# Altium project IOT_Masterv2_301115.PrjPcb
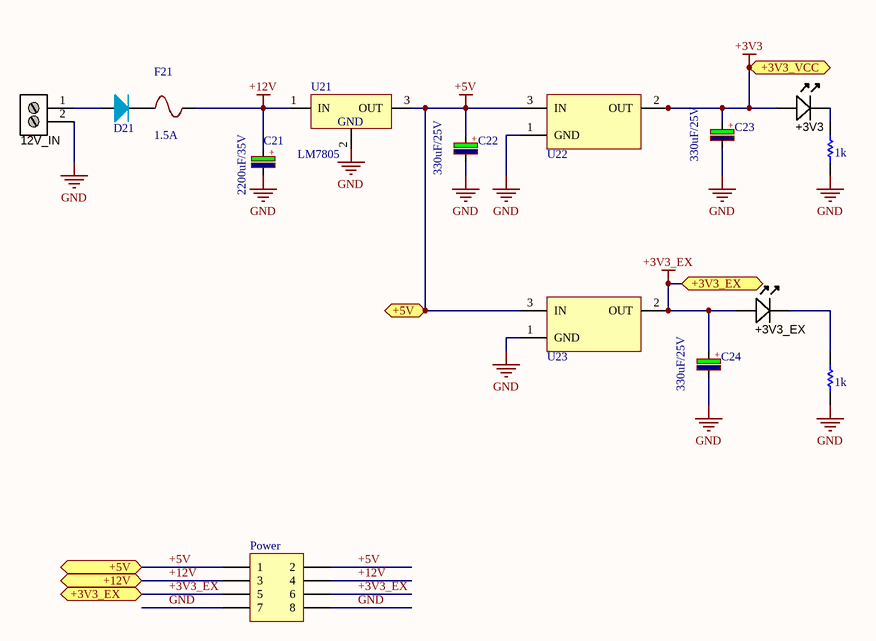
[diagram p0: IOT_Masterv2_301115_Power.SchDoc]
3 sheets, 104 parts. Net scope: flat (ports and power ports of the same name join across sheets).
Board file: IOT_Masterv2_301115.PcbDoc
Sheets:
  IOT_Masterv2_301115_Power.SchDoc
  IOT_Masterv2_301115_Comunication.SchDoc
  Measure_v2_301115.SchDoc

## Sheet IOT_Masterv2_301115_Power.SchDoc
size A

### Parts
12V_IN  Stackable ScrewTerm  [2P_PCB_ScrewTerm_200mil]  (value not drawn)
+3V3  Blue  [LED-0805-K]  (value not drawn)
+3V3_EX  Blue  [LED-0805-K]  (value not drawn)
C21  2200uF/35V  [CP_1000uF_25V]
C22  330uF/25V  [CP1.5/3.4]
C23  330uF/25V  [CP1.5/3.4]
C24  330uF/25V  [CP1.5/3.4]
D21  Diode  [DO-214AC]  (value not drawn)
F21  1.5A  [FUSE_SR-5-BK]
Power  Header 4X2  [HDR2X4]  (value not drawn)
R21  value 1k  [RESC2012N_F]  (hidden comment: Res_0805_1k)
R22  value 1k  [RESC2012N_F]  (hidden comment: Res_0805_1k)
U21  LM7805  [TO-220]
U22  AS1117  [SOT223-4N]  (value not drawn)
U23  AS1117  [SOT223-4N]  (value not drawn)

### Ports
+3V3_EX, +3V3_VCC, +5V, +12V

### Nets
+3V3: +3V3.A C23.1 U22.2(OUT) U22.4 ; port +3V3_VCC
+3V3_EX: +3V3_EX.A C24.1 Power.5 Power.6 U23.2(OUT) U23.4 ; port +3V3_EX
+5V: C22.1 Power.1 Power.2 U21.3(OUT) U22.3(IN) U23.3(IN) ; port +5V
+12V: C21.1 F21.2 Power.3 Power.4 U21.1(IN) ; port +12V
GND: 12V_IN.2 C21.2 C22.2 C23.2 C24.2 Power.7 Power.8 R21.2 R22.2 U21.2 U22.1(GND) U23.1(GND)
Net12V_IN_1: 12V_IN.1 D21.1(A)
Net+3V3_EX_K: +3V3_EX.K R22.1
Net+3V3_K: +3V3.K R21.1
NetD21_2: D21.2(K) F21.1

### Notes on the sheet
- (in symbol CP4) +
- (in symbol LM78xx) GND

### Library data of the parts
12V_IN = 2P_ScrewTerm_90S_3.81MM: Terminal Block Screw Type THT 2-Position 3.81mm pitch; Manufacturer 1: Tyco Electronics; Manufacturer Part Number 1: 1776113-2; Value: 2 position; Pitch: 0.150" (3.81mm); Positions Per Level: 2; Package / Case: Side Entry; 3.81mm pitch; Category: Connectors Interconnects; Color: Black; Supplier 1: Digi-Key; Supplier Part Number 1: A97976-ND
+3V3 +3V3_EX = LED_SMD_Blue_0805_100mcd: LED 0805 SMD Blue 100mcd 470nm; Manufacturer 1: Ligitek; Manufacturer Part Number 1: LG-170DBKZ-CT; Ratings: 100 mcd; 470 nm; Package / Case: 0805; Material: InGaN/GaN; Value: Blue; Color: Blue
C21-C24 = CP4: Cap 1000uF/16V - 220uF/50V; Description 5: 4,7uF>10uF/250V_3,3uF>10uF/400V - 2,2uF>4,7uF/450V; Description 1: 2200uF-3300uF/6,3V - 1000uF-2200uF/10V; Description 2: 1000uF/16V - 470uF => 1000uF/25V - 100uF/100V; Description 3: 330uF>470uF/35V_220uF>470uF/50V_10uF>22uF/250V; Description 4: 220uF => 330uF/63V - 10uF =>33uF/160 - 200V; Value: 1000uF/16V
D21 = Diode: pin to pad: 1>A 2>K
F21 = Fuse
Power = Header 4X2: Header, 4-Pin, Dual row; LatestRevisionDate: 17-Jul-2002; LatestRevisionNote: Re-released for DXP Platform.; Publisher: Altium Limited
R21 R22 = Res
U21 = LM78xx

## Sheet IOT_Masterv2_301115_Comunication.SchDoc
size A
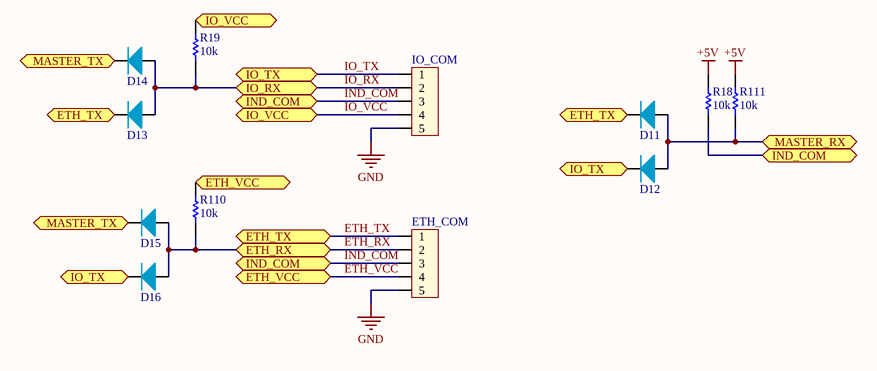
[diagram p1: IOT_Masterv2_301115_Comunication.SchDoc]

### Parts
D11  Diode  [DO-214AC]  (value not drawn)
D12  Diode  [DO-214AC]  (value not drawn)
D13  Diode  [DO-214AC]  (value not drawn)
D14  Diode  [DO-214AC]  (value not drawn)
D15  Diode  [DO-214AC]  (value not drawn)
D16  Diode  [DO-214AC]  (value not drawn)
ETH_COM  JP5  [CON5]  (value not drawn)
IO_COM  JP5  [CON5]  (value not drawn)
R18  value 10k  [RESC2012N_F]  (hidden comment: Res)
R19  value 10k  [RESC2012N_F]  (hidden comment: Res)
R110  value 10k  [RESC2012N_F]  (hidden comment: Res)
R111  value 10k  [RESC2012N_F]  (hidden comment: Res)

### Ports
ETH_RX, ETH_TX, ETH_VCC, IND_COM, IO_RX, IO_TX, IO_VCC, MASTER_RX, MASTER_TX

### Nets
+5V: R18.2 R111.2
GND: ETH_COM.5 IO_COM.5
ETH_RX: D15.1(A) D16.1(A) ETH_COM.2 R110.1 ; port ETH_RX
ETH_TX: D11.2(K) D13.2(K) ETH_COM.1 ; port ETH_TX
ETH_VCC: ETH_COM.4 R110.2 ; port ETH_VCC
IND_COM: ETH_COM.3 IO_COM.3 R18.1 ; port IND_COM
IO_RX: D13.1(A) D14.1(A) IO_COM.2 R19.1 ; port IO_RX
IO_TX: D12.2(K) D16.2(K) IO_COM.1 ; port IO_TX
IO_VCC: IO_COM.4 R19.2 ; port IO_VCC
NetD11_1: D11.1(A) D12.1(A) R111.1 ; port MASTER_RX
NetD14_2: D14.2(K) D15.2(K) ; port MASTER_TX

### Library data of the parts
D11-D16 = Diode: pin to pad: 1>A 2>K
ETH_COM IO_COM = Con5: Connector 5; Value: Connector 5

## Sheet Measure_v2_301115.SchDoc
size A3
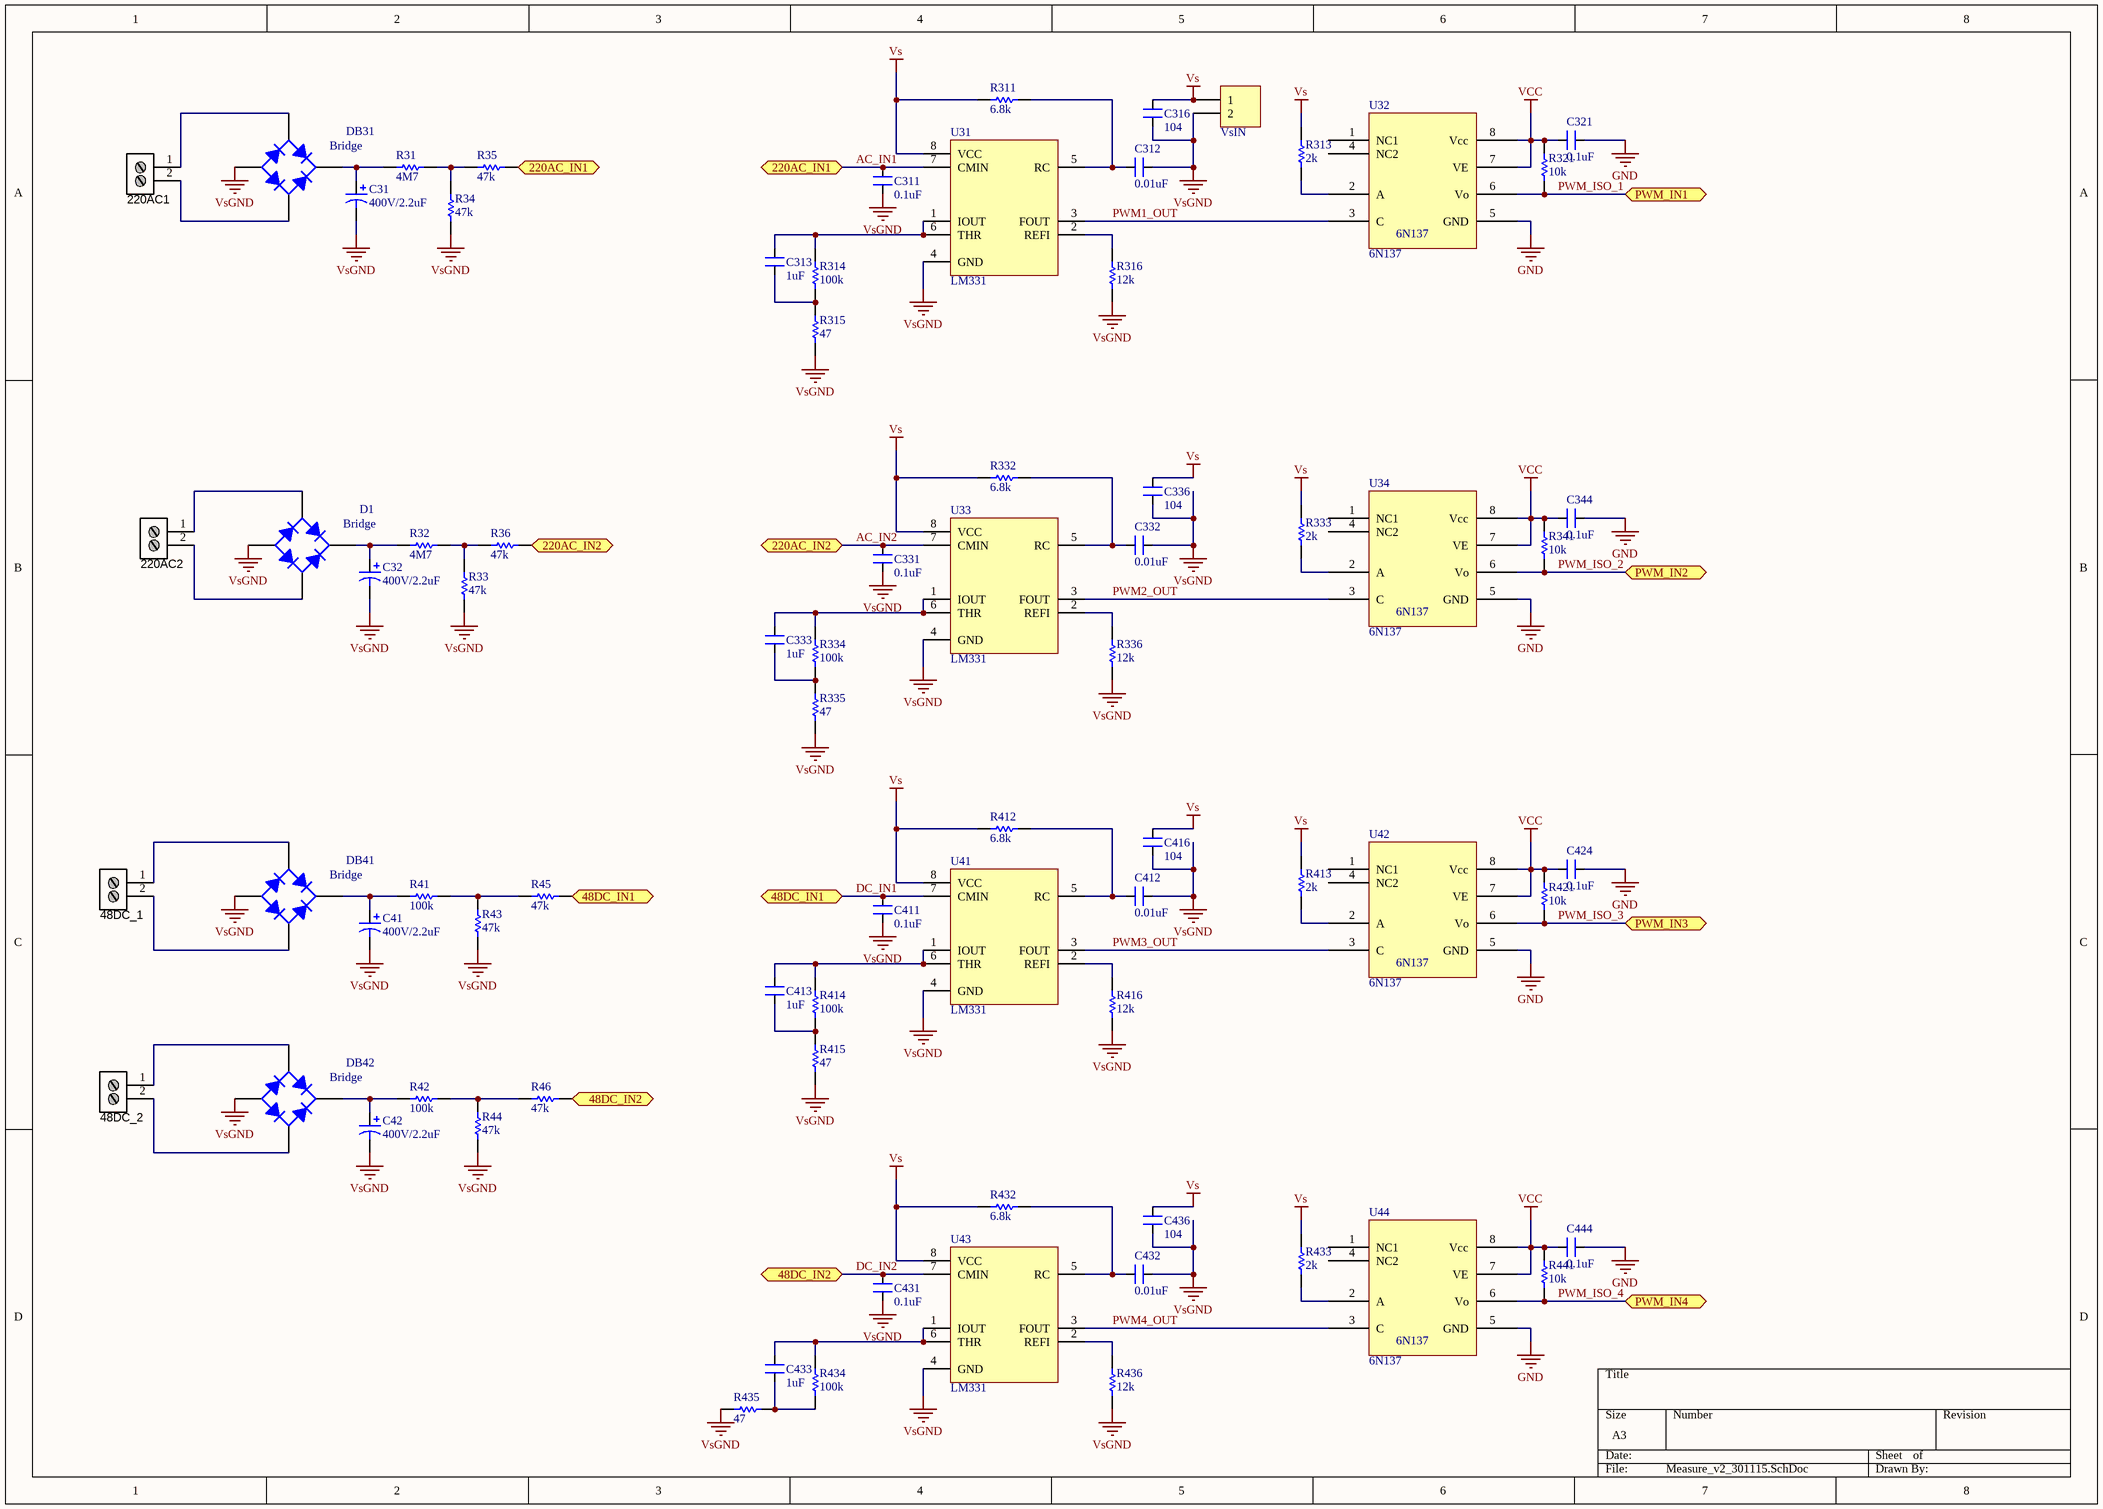
[diagram p2: Measure_v2_301115.SchDoc]

### Parts
48DC_1  Stackable ScrewTerm  [2P_PCB_ScrewTerm_200mil]  (value not drawn)
48DC_2  Stackable ScrewTerm  [2P_PCB_ScrewTerm_200mil]  (value not drawn)
220AC1  Stackable ScrewTerm  [2P_PCB_ScrewTerm_200mil]  (value not drawn)
220AC2  Stackable ScrewTerm  [2P_PCB_ScrewTerm_200mil]  (value not drawn)
C31  value 400V/2.2uF  [CAP 3.8mm]  (hidden comment: Cap)
C32  value 400V/2.2uF  [CAP 3.8mm]  (hidden comment: Cap)
C41  value 400V/2.2uF  [CAP 3.8mm]  (hidden comment: Cap)
C42  value 400V/2.2uF  [CAP 3.8mm]  (hidden comment: Cap)
C311  value 0.1uF  [CAPC2012N_F]  (hidden comment: CAP NP)
C312  value 0.01uF  [CAPC2012N_F]  (hidden comment: CAP NP)
C313  value 1uF  [CAPC2012N_F]  (hidden comment: CAP NP)
C316  value 104  [CAPC2012N_F]  (hidden comment: CAP NP)
C321  value 0.1uF  [CAPC2012N_F]  (hidden comment: CAP NP)
C331  value 0.1uF  [CAPC2012N_F]  (hidden comment: CAP NP)
C332  value 0.01uF  [CAPC2012N_F]  (hidden comment: CAP NP)
C333  value 1uF  [CAPC2012N_F]  (hidden comment: CAP NP)
C336  value 104  [CAPC2012N_F]  (hidden comment: CAP NP)
C344  value 0.1uF  [CAPC2012N_F]  (hidden comment: CAP NP)
C411  value 0.1uF  [CAPC2012N_F]  (hidden comment: CAP NP)
C412  value 0.01uF  [CAPC2012N_F]  (hidden comment: CAP NP)
C413  value 1uF  [CAPC2012N_F]  (hidden comment: CAP NP)
C416  value 104  [CAPC2012N_F]  (hidden comment: CAP NP)
C424  value 0.1uF  [CAPC2012N_F]  (hidden comment: CAP NP)
C431  value 0.1uF  [CAPC2012N_F]  (hidden comment: CAP NP)
C432  value 0.01uF  [CAPC2012N_F]  (hidden comment: CAP NP)
C433  value 1uF  [CAPC2012N_F]  (hidden comment: CAP NP)
C436  value 104  [CAPC2012N_F]  (hidden comment: CAP NP)
C444  value 0.1uF  [CAPC2012N_F]  (hidden comment: CAP NP)
D1  Bridge  [MB6S]
DB31  Bridge  [MB6S]
DB41  Bridge  [MB6S]
DB42  Bridge  [MB6S]
R31  value 4M7  [RESTH_0.0R_AXIAL-0.6]  (hidden comment: Res)
R32  value 4M7  [RESTH_0.0R_AXIAL-0.6]  (hidden comment: Res)
R33  value 47k  [RESTH_0.0R_AXIAL-0.6]  (hidden comment: Res)
R34  value 47k  [RESTH_0.0R_AXIAL-0.6]  (hidden comment: Res)
R35  value 47k  [RESC2012N_F]  (hidden comment: Res)
R36  value 47k  [RESC2012N_F]  (hidden comment: Res)
R41  value 100k  [RESTH_0.0R_AXIAL-0.6]  (hidden comment: Res)
R42  value 100k  [RESTH_0.0R_AXIAL-0.6]  (hidden comment: Res)
R43  value 47k  [RESTH_0.0R_AXIAL-0.6]  (hidden comment: Res)
R44  value 47k  [RESTH_0.0R_AXIAL-0.6]  (hidden comment: Res)
R45  value 47k  [RESC2012N_F]  (hidden comment: Res)
R46  value 47k  [RESC2012N_F]  (hidden comment: Res)
R311  value 6.8k  [RESC2012N_F]  (hidden comment: Res)
R313  value 2k  [RESC2012N_F]  (hidden comment: Res)
R314  value 100k  [RESC2012N_F]  (hidden comment: Res)
R315  value 47  [RESC2012N_F]  (hidden comment: Res)
R316  value 12k  [RESC2012N_F]  (hidden comment: Res)
R321  value 10k  [RESC2012N_F]  (hidden comment: Res)
R332  value 6.8k  [RESC2012N_F]  (hidden comment: Res)
R333  value 2k  [RESC2012N_F]  (hidden comment: Res)
R334  value 100k  [RESC2012N_F]  (hidden comment: Res)
R335  value 47  [RESC2012N_F]  (hidden comment: Res)
R336  value 12k  [RESC2012N_F]  (hidden comment: Res)
R341  value 10k  [RESC2012N_F]  (hidden comment: Res)
R412  value 6.8k  [RESC2012N_F]  (hidden comment: Res)
R413  value 2k  [RESC2012N_F]  (hidden comment: Res)
R414  value 100k  [RESC2012N_F]  (hidden comment: Res)
R415  value 47  [RESC2012N_F]  (hidden comment: Res)
R416  value 12k  [RESC2012N_F]  (hidden comment: Res)
R421  value 10k  [RESC2012N_F]  (hidden comment: Res)
R432  value 6.8k  [RESC2012N_F]  (hidden comment: Res)
R433  value 2k  [RESC2012N_F]  (hidden comment: Res)
R434  value 100k  [RESC2012N_F]  (hidden comment: Res)
R435  value 47  [RESC2012N_F]  (hidden comment: Res)
R436  value 12k  [RESC2012N_F]  (hidden comment: Res)
R441  value 10k  [RESC2012N_F]  (hidden comment: Res)
U31  LM331  [DIP8-300]
U32  6N137  [SMD-8]
U33  LM331  [DIP8-300]
U34  6N137  [SMD-8]
U41  LM331  [DIP8-300]
U42  6N137  [SMD-8]
U43  LM331  [DIP8-300]
U44  6N137  [SMD-8]
VsIN  Header 2  [HDR1X2]  (value not drawn)

### Ports
48DC_IN1, 48DC_IN2, 220AC_IN1, 220AC_IN2, PWM_IN1, PWM_IN2, PWM_IN3, PWM_IN4

### Nets
GND: C321.1 C344.1 C424.1 C444.1 U32.5(GND) U34.5(GND) U42.5(GND) U44.5(GND)
VCC: C321.2 C344.2 C424.2 C444.2 R321.2 R341.2 R421.2 R441.2 U32.7(VE) U32.8(Vcc) U34.7(VE) U34.8(Vcc) U42.7(VE) U42.8(Vcc) U44.7(VE) U44.8(Vcc)
Vs: C316.2 C336.2 C416.2 C436.2 R311.1 R313.2 R332.1 R333.2 R412.1 R413.2 R432.1 R433.2 U31.8(VCC) U33.8(VCC) U41.8(VCC) U43.8(VCC) VsIN.1
VsGND: C31.2 C32.2 C41.2 C42.2 C311.1 C312.1 C316.1 C331.1 C332.1 C336.1 C411.1 C412.1 C416.1 C431.1 C432.1 C436.1 D1.3(A) DB31.3(A) DB41.3(A) DB42.3(A) R33.1 R34.1 R43.1 R44.1 R315.1 R316.1 R335.1 R336.1 R415.1 R416.1 R435.2 R436.1 U31.4(GND) U33.4(GND) U41.4(GND) U43.4(GND) VsIN.2
AC_IN1: C311.2 R35.2 U31.7(CMIN) ; port 220AC_IN1
AC_IN2: C331.2 R36.2 U33.7(CMIN) ; port 220AC_IN2
DC_IN1: C411.2 R45.2 U41.7(CMIN) ; port 48DC_IN1
DC_IN2: C431.2 R46.2 U43.7(CMIN) ; port 48DC_IN2
PWM1_OUT: U31.3(FOUT) U32.3(C)
PWM2_OUT: U33.3(FOUT) U34.3(C)
PWM3_OUT: U41.3(FOUT) U42.3(C)
PWM4_OUT: U43.3(FOUT) U44.3(C)
PWM_ISO_1: R321.1 U32.6(Vo) ; port PWM_IN1
PWM_ISO_2: R341.1 U34.6(Vo) ; port PWM_IN2
PWM_ISO_3: R421.1 U42.6(Vo) ; port PWM_IN3
PWM_ISO_4: R441.1 U44.6(Vo) ; port PWM_IN4
Net48DC_1_1: 48DC_1.1 DB41.4(C)
Net48DC_1_2: 48DC_1.2 DB41.2(C)
Net48DC_2_1: 48DC_2.1 DB42.4(C)
Net48DC_2_2: 48DC_2.2 DB42.2(C)
Net220AC1_1: 220AC1.1 DB31.4(C)
Net220AC1_2: 220AC1.2 DB31.2(C)
Net220AC2_1: 220AC2.1 D1.4(C)
Net220AC2_2: 220AC2.2 D1.2(C)
NetC31_1: C31.1 DB31.1(K) R31.1
NetC32_1: C32.1 D1.1(K) R32.1
NetC41_1: C41.1 DB41.1(K) R41.1
NetC42_1: C42.1 DB42.1(K) R42.1
NetC312_2: C312.2 R311.2 U31.5(RC)
NetC313_1: C313.1 R314.2 U31.1(IOUT) U31.6(THR)
NetC313_2: C313.2 R314.1 R315.2
NetC332_2: C332.2 R332.2 U33.5(RC)
NetC333_1: C333.1 R334.2 U33.1(IOUT) U33.6(THR)
NetC333_2: C333.2 R334.1 R335.2
NetC412_2: C412.2 R412.2 U41.5(RC)
NetC413_1: C413.1 R414.2 U41.1(IOUT) U41.6(THR)
NetC413_2: C413.2 R414.1 R415.2
NetC432_2: C432.2 R432.2 U43.5(RC)
NetC433_1: C433.1 R434.2 U43.1(IOUT) U43.6(THR)
NetC433_2: C433.2 R434.1 R435.1
NetR31_2: R31.2 R34.2 R35.1
NetR32_2: R32.2 R33.2 R36.1
NetR41_2: R41.2 R43.2 R45.1
NetR42_2: R42.2 R44.2 R46.1
NetR313_1: R313.1 U32.2(A)
NetR316_2: R316.2 U31.2(REFI)
NetR333_1: R333.1 U34.2(A)
NetR336_2: R336.2 U33.2(REFI)
NetR413_1: R413.1 U42.2(A)
NetR416_2: R416.2 U41.2(REFI)
NetR433_1: R433.1 U44.2(A)
NetR436_2: R436.2 U43.2(REFI)

Not connected (* = marked no-connect by the designer): U32 1(NC1) 4(NC2); U34 1(NC1) 4(NC2); U42 1(NC1) 4(NC2); U44 1(NC1) 4(NC2)

### Library data of the parts
48DC_1 48DC_2 220AC1 220AC2 = 2P_ScrewTerm_90S_3.81MM: as 12V_IN on sheet IOT_Masterv2_301115_Power; Package / Case: Side Entry; 3.81mm pitch; Category: Connectors Interconnects; Color: Black; Supplier 1: Digi-Key; Supplier Part Number 1: A97976-ND
D1 DB31 DB41 DB42 = Bridge1: Full Wave Diode Bridge; pin to pad: 2>3 3>4 4>2; Published: 8-Jun-2000; LatestRevisionDate: 29-May-2009; LatestRevisionNote: Sch pins A & K swapped.; DatasheetVersion: E2732B; PackageReference: D-38; Publisher: Altium Limited; PackageDescription: Bridge Rectifier; 4 Terminals; Body 9.4 x 9.4 mm (typ); Pitch 5.08 mm
VsIN = Header 2: Header, 2-Pin; LatestRevisionDate: 17-Jul-2002; LatestRevisionNote: Re-released for DXP Platform.; Publisher: Altium Limited

## Nets that join several sheets
+5V: IOT_Masterv2_301115_Power (6 pins), IOT_Masterv2_301115_Comunication (R18.2 R111.2)
GND: IOT_Masterv2_301115_Power (12 pins), IOT_Masterv2_301115_Comunication (ETH_COM.5 IO_COM.5), Measure_v2_301115 (8 pins)